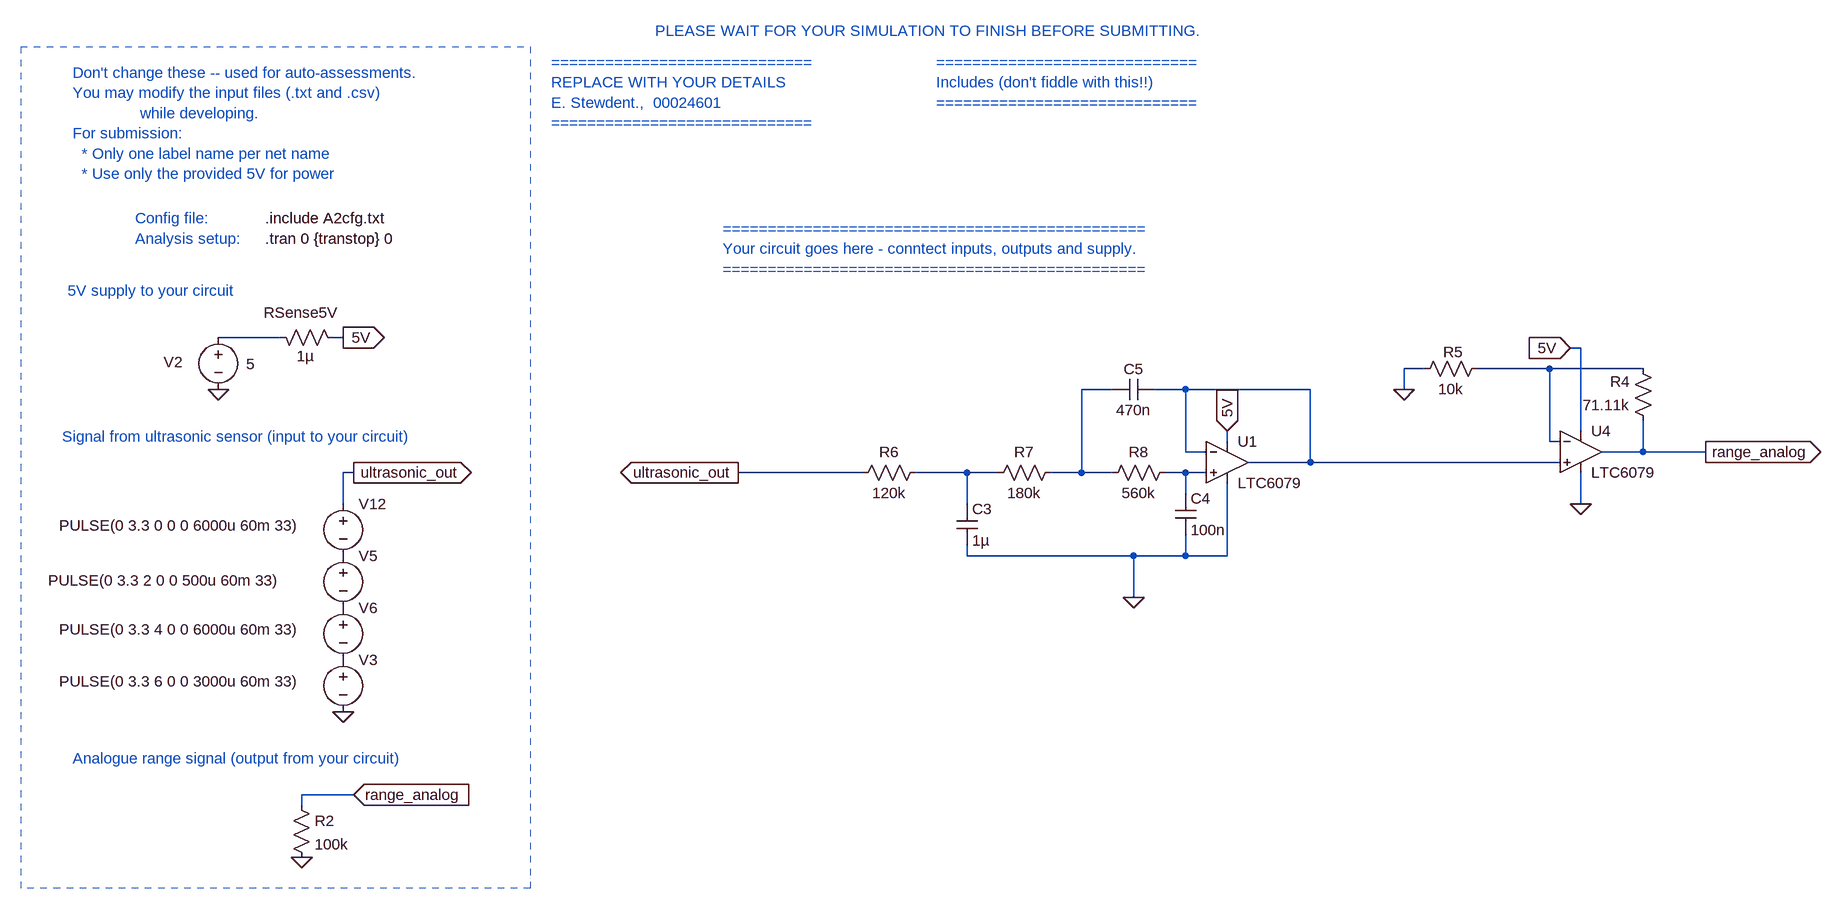
[diagram p0: schematic E344_Ass2_US2A.asc]
E344_Ass2_US2A.asc, the LTspice schematic file:
Version 4
SHEET 1 3140 2124
WIRE -1968 -976 -2064 -976
WIRE -1872 -976 -1888 -976
WIRE 32 -960 16 -960
WIRE -208 -928 -240 -928
WIRE -16 -928 -128 -928
WIRE 128 -928 -16 -928
WIRE -688 -896 -736 -896
WIRE -576 -896 -624 -896
WIRE -384 -896 -576 -896
WIRE -240 -896 -240 -928
WIRE 32 -832 32 -960
WIRE -512 -816 -512 -832
WIRE -16 -816 -16 -928
WIRE 0 -816 -16 -816
WIRE -576 -800 -576 -896
WIRE -544 -800 -576 -800
WIRE 128 -800 128 -848
WIRE 128 -800 64 -800
WIRE 224 -800 128 -800
WIRE -384 -784 -384 -896
WIRE -384 -784 -480 -784
WIRE 0 -784 -384 -784
WIRE -1856 -768 -1872 -768
WIRE -1072 -768 -1264 -768
WIRE -912 -768 -992 -768
WIRE -864 -768 -912 -768
WIRE -736 -768 -736 -896
WIRE -736 -768 -784 -768
WIRE -688 -768 -736 -768
WIRE -576 -768 -608 -768
WIRE -544 -768 -576 -768
WIRE -576 -736 -576 -768
WIRE -1872 -720 -1872 -768
WIRE -912 -720 -912 -768
WIRE 32 -720 32 -768
WIRE -912 -640 -912 -656
WIRE -656 -640 -912 -640
WIRE -576 -640 -576 -672
WIRE -576 -640 -656 -640
WIRE -512 -640 -512 -752
WIRE -512 -640 -576 -640
WIRE -656 -576 -656 -640
WIRE -1856 -272 -1936 -272
WIRE -1936 -256 -1936 -272
FLAG -1872 -976 5V
IOPIN -1872 -976 Out
FLAG -2064 -896 0
FLAG 16 -960 5V
IOPIN 16 -960 In
FLAG -1872 -400 0
FLAG -1856 -768 ultrasonic_out
IOPIN -1856 -768 Out
FLAG -1264 -768 ultrasonic_out
IOPIN -1264 -768 Out
FLAG 224 -800 range_analog
IOPIN 224 -800 Out
FLAG -1856 -272 range_analog
IOPIN -1856 -272 In
FLAG -1936 -176 0
FLAG -240 -896 0
FLAG -656 -576 0
FLAG -512 -832 5V
IOPIN -512 -832 In
FLAG 32 -720 0
SYMBOL voltage -2064 -992 R0
WINDOW 123 0 0 Left 0
WINDOW 39 0 0 Left 0
WINDOW 0 -84 54 Left 2
WINDOW 3 43 57 Left 2
SYMATTR InstName V2
SYMATTR Value 5
SYMBOL res -1984 -992 M90
WINDOW 0 -7 47 VBottom 2
WINDOW 3 29 54 VTop 2
SYMATTR InstName RSense5V
SYMATTR Value 1µ
SYMBOL Opamps\\LTC6079 32 -800 R0
SYMATTR InstName U4
SYMBOL voltage -1872 -736 R0
WINDOW 123 0 0 Left 0
WINDOW 39 0 0 Left 0
WINDOW 3 -437 49 Left 2
SYMATTR Value PULSE(0 3.3 0 0 0 6000u 60m 33)
SYMATTR InstName V12
SYMBOL voltage -1872 -656 R0
WINDOW 123 0 0 Left 0
WINDOW 39 0 0 Left 0
WINDOW 3 -454 54 Left 2
SYMATTR Value PULSE(0 3.3 2 0 0 500u 60m 33)
SYMATTR InstName V5
SYMBOL voltage -1872 -576 R0
WINDOW 123 0 0 Left 0
WINDOW 39 0 0 Left 0
WINDOW 3 -437 49 Left 2
SYMATTR Value PULSE(0 3.3 4 0 0 6000u 60m 33)
SYMATTR InstName V6
SYMBOL voltage -1872 -496 R0
WINDOW 123 0 0 Left 0
WINDOW 39 0 0 Left 0
WINDOW 3 -437 49 Left 2
SYMATTR Value PULSE(0 3.3 6 0 0 3000u 60m 33)
SYMATTR InstName V3
SYMBOL res -1952 -272 R0
SYMATTR InstName R2
SYMATTR Value 100k
SYMBOL res 144 -832 R180
WINDOW 0 36 76 Left 2
WINDOW 3 36 40 Left 2
SYMATTR InstName R4
SYMATTR Value 71.11k
SYMBOL res -224 -912 R270
WINDOW 0 26 60 VTop 2
WINDOW 3 0 56 VBottom 2
SYMATTR InstName R5
SYMATTR Value 10k
SYMBOL Opamps\\LTC6079 -512 -784 R0
SYMATTR InstName U1
SYMBOL res -976 -784 R90
WINDOW 0 0 56 VBottom 2
WINDOW 3 32 56 VTop 2
SYMATTR InstName R6
SYMATTR Value 120k
SYMBOL res -768 -784 R90
WINDOW 0 0 56 VBottom 2
WINDOW 3 32 56 VTop 2
SYMATTR InstName R7
SYMATTR Value 180k
SYMBOL res -592 -784 R90
WINDOW 0 0 56 VBottom 2
WINDOW 3 32 56 VTop 2
SYMATTR InstName R8
SYMATTR Value 560k
SYMBOL cap -928 -720 R0
SYMATTR InstName C3
SYMATTR Value 1µ
SYMBOL cap -592 -736 R0
SYMATTR InstName C4
SYMATTR Value 100n
SYMBOL cap -624 -912 R90
WINDOW 0 0 32 VBottom 2
WINDOW 3 32 32 VTop 2
SYMATTR InstName C5
SYMATTR Value 470n
TEXT -1992 -1128 Left 2 !.tran 0 {transtop} 0
TEXT -1992 -1160 Left 2 !.include A2cfg.txt
TEXT -2288 -1384 Left 2 ;Don't change these -- used for auto-assessments.\nYou may modify the input files (.txt and .csv) \n               while developing.\nFor submission: \n  * Only one label name per net name\n  * Use only the provided 5V for power
TEXT -2192 -1160 Left 2 ;Config file:
TEXT -2192 -1128 Left 2 ;Analysis setup:
TEXT -1552 -1400 Left 2 ;=============================\nREPLACE WITH YOUR DETAILS\nE. Stewdent.,  00024601\n=============================
TEXT -960 -1400 Left 2 ;=============================\nIncludes (don't fiddle with this!!)\n=============================
TEXT -1288 -1144 Left 2 ;===============================================\nYour circuit goes here - conntect inputs, outputs and supply.\n===============================================
TEXT -1392 -1448 Left 2 ;PLEASE WAIT FOR YOUR SIMULATION TO FINISH BEFORE SUBMITTING.
TEXT -2304 -824 Left 2 ;Signal from ultrasonic sensor (input to your circuit)
TEXT -2296 -1048 Left 2 ;5V supply to your circuit
TEXT -2288 -328 Left 2 ;Analogue range signal (output from your circuit)
LINE Normal -1584 -1424 -1584 -128 2
LINE Normal -2368 -1424 -1584 -1424 2
LINE Normal -1584 -128 -2368 -128 2
LINE Normal -1584 -144 -1584 -144 2
LINE Normal -2368 -1424 -2368 -128 2

The netlist it stands for:
* E344_Ass2_US2A.asc
V2 N001 0 5
RSense5V N001 5V 1µ
XU4 N004 N002 5V 0 range_analog LTC6078  ; LTC6079, pins In+ In- V+ V- OUT
V12 ultrasonic_out P001 PULSE(0 3.3 0 0 0 6000u 60m 33)
V5 P001 P002 PULSE(0 3.3 2 0 0 500u 60m 33)
V6 P002 P003 PULSE(0 3.3 4 0 0 6000u 60m 33)
V3 P003 0 PULSE(0 3.3 6 0 0 3000u 60m 33)
R2 range_analog 0 100k
R4 range_analog N002 71.11k
R5 0 N002 10k
XU1 N006 N004 5V 0 N004 LTC6078  ; LTC6079, pins In+ In- V+ V- OUT
R6 N005 ultrasonic_out 120k
R7 N003 N005 180k
R8 N006 N003 560k
C3 N005 0 1µ
C4 N006 0 100n
C5 N004 N003 470n
.tran 0 {transtop} 0
.include A2cfg.txt
* Don't change these -- used for auto-assessments.
* You may modify the input files (.txt and .csv)
*                while developing.
* For submission:
*   * Only one label name per net name
*   * Use only the provided 5V for power
* Config file:
* Analysis setup:
* =============================
* REPLACE WITH YOUR DETAILS
* E. Stewdent.,  00024601
* =============================
* =============================
* Includes (don't fiddle with this!!)
* =============================
* ===============================================
* Your circuit goes here - conntect inputs, outputs and supply.
* ===============================================
* PLEASE WAIT FOR YOUR SIMULATION TO FINISH BEFORE SUBMITTING.
* Signal from ultrasonic sensor (input to your circuit)
* 5V supply to your circuit
* Analogue range signal (output from your circuit)
.lib LTC5.lib
.backanno
.end